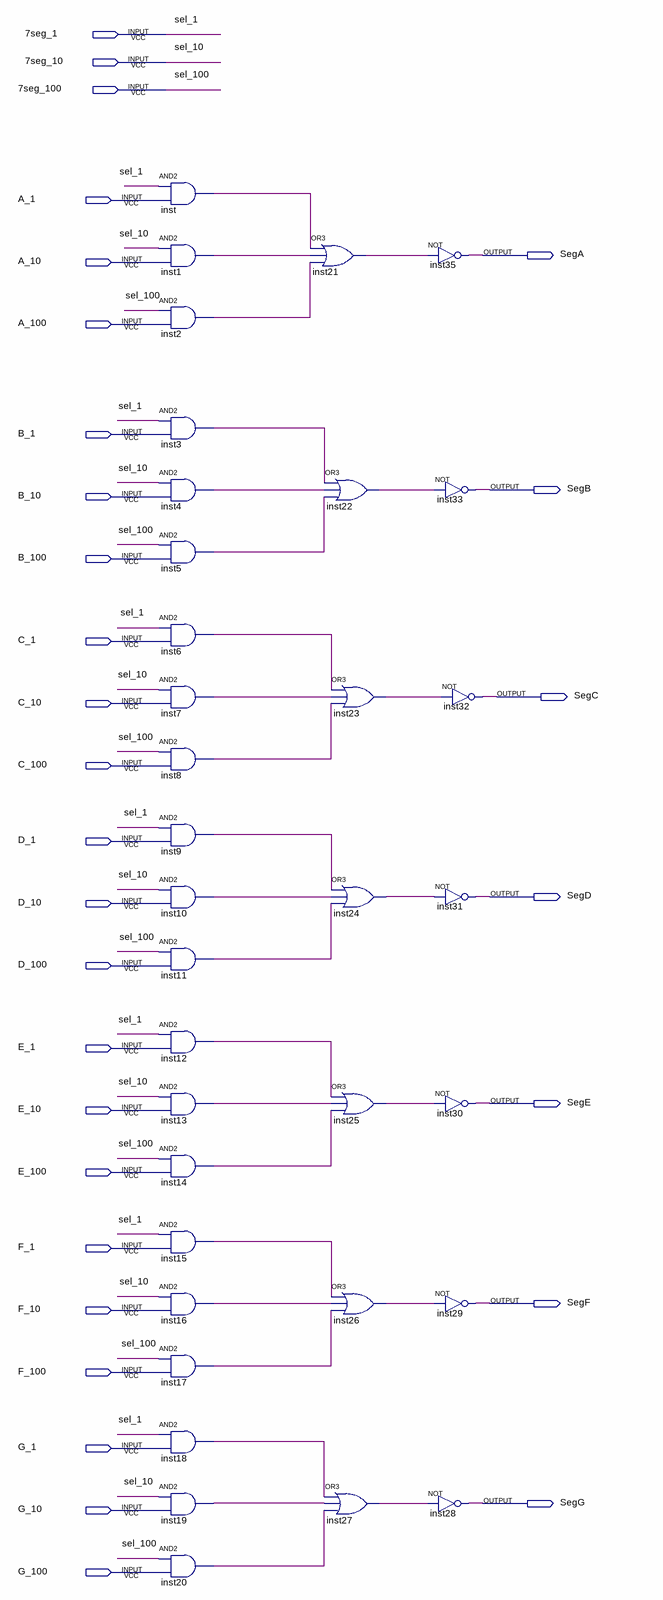
[diagram p0: schematic sheet]
// Quartus schematic multiplexador.bdf as structural Verilog: 35 symbols, 31 pins
module multiplexador (
  input  \7seg_1 ,
  input  \7seg_10 ,
  input  \7seg_100 ,
  input  A_1,
  input  A_10,
  input  A_100,
  input  B_1,
  input  B_10,
  input  B_100,
  input  C_1,
  input  C_10,
  input  C_100,
  input  D_1,
  input  D_10,
  input  D_100,
  input  E_1,
  input  E_10,
  input  E_100,
  input  F_1,
  input  F_10,
  input  F_100,
  input  G_1,
  input  G_10,
  input  G_100,
  output SegA,
  output SegB,
  output SegC,
  output SegD,
  output SegE,
  output SegF,
  output SegG
);

  wire inst1_out, inst2_out, inst3_out, inst4_out, inst5_out, inst6_out, inst7_out, inst8_out, inst9_out,
       inst10_out, inst11_out, inst12_out, inst13_out, inst14_out, inst15_out, inst16_out, inst17_out,
       inst18_out, inst19_out, inst20_out, inst21_out, inst22_out, inst23_out, inst24_out, inst25_out,
       inst26_out, inst27_out, inst_out;

  and inst (inst_out, \7seg_1 , A_1);
  and inst1 (inst1_out, \7seg_10 , A_10);
  and inst2 (inst2_out, \7seg_100 , A_100);
  and inst3 (inst3_out, \7seg_1 , B_1);
  and inst4 (inst4_out, \7seg_10 , B_10);
  and inst5 (inst5_out, \7seg_100 , B_100);
  and inst6 (inst6_out, \7seg_1 , C_1);
  and inst7 (inst7_out, \7seg_10 , C_10);
  and inst8 (inst8_out, \7seg_100 , C_100);
  and inst9 (inst9_out, \7seg_1 , D_1);
  and inst10 (inst10_out, \7seg_10 , D_10);
  and inst11 (inst11_out, \7seg_100 , D_100);
  and inst12 (inst12_out, \7seg_1 , E_1);
  and inst13 (inst13_out, \7seg_10 , E_10);
  and inst14 (inst14_out, \7seg_100 , E_100);
  and inst15 (inst15_out, \7seg_1 , F_1);
  and inst16 (inst16_out, \7seg_10 , F_10);
  and inst17 (inst17_out, \7seg_100 , F_100);
  and inst18 (inst18_out, \7seg_1 , G_1);
  and inst19 (inst19_out, \7seg_10 , G_10);
  and inst20 (inst20_out, \7seg_100 , G_100);
  or inst21 (inst21_out, inst_out, inst1_out, inst2_out);
  or inst22 (inst22_out, inst3_out, inst4_out, inst5_out);
  or inst23 (inst23_out, inst6_out, inst7_out, inst8_out);
  or inst24 (inst24_out, inst9_out, inst10_out, inst11_out);
  or inst25 (inst25_out, inst12_out, inst13_out, inst14_out);
  or inst26 (inst26_out, inst15_out, inst16_out, inst17_out);
  or inst27 (inst27_out, inst18_out, inst19_out, inst20_out);
  not inst35 (SegA, inst21_out);
  not inst33 (SegB, inst22_out);
  not inst32 (SegC, inst23_out);
  not inst31 (SegD, inst24_out);
  not inst30 (SegE, inst25_out);
  not inst29 (SegF, inst26_out);
  not inst28 (SegG, inst27_out);

  // Other names for the same wires on the sheet: sel_1 = \7seg_1 ; sel_10 = \7seg_10 ; sel_100 = \7seg_100 
endmodule
